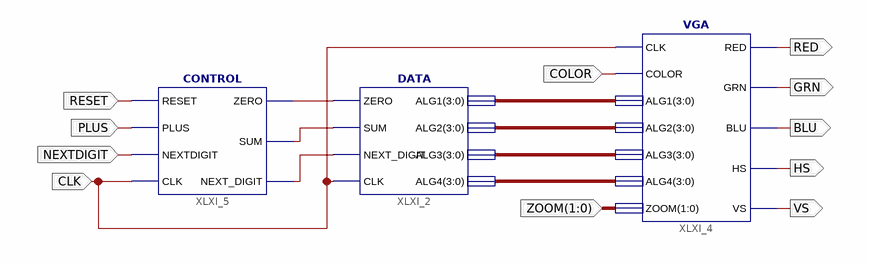
[diagram p0: schematic sheet 1]
// Xilinx ISE schematic MODULE.sch (spartan3) as structural Verilog: 3 symbols, 11 ports
module MODULE (
  input  RESET,
  input  PLUS,
  input  NEXTDIGIT,
  input  CLK,
  input  COLOR,
  input  [1:0] ZOOM,
  output RED,
  output GRN,
  output BLU,
  output VS,
  output HS
);

  wire XLXN_7, XLXN_8, XLXN_9;
  wire [3:0] XLXN_13, XLXN_14, XLXN_15, XLXN_16;

  DATA XLXI_2 (
    .ZERO(XLXN_7), .SUM(XLXN_8), .NEXT_DIGIT(XLXN_9), .CLK(CLK), .ALG1(XLXN_13), .ALG2(XLXN_14),
    .ALG3(XLXN_15), .ALG4(XLXN_16));
  CONTROL XLXI_5 (
    .RESET(RESET), .PLUS(PLUS), .NEXTDIGIT(NEXTDIGIT), .CLK(CLK), .ZERO(XLXN_7), .SUM(XLXN_8),
    .NEXT_DIGIT(XLXN_9));
  VGA XLXI_4 (
    .CLK(CLK), .COLOR(COLOR), .ALG1(XLXN_13), .ALG2(XLXN_14), .ALG3(XLXN_15), .ALG4(XLXN_16), .ZOOM(ZOOM),
    .RED(RED), .GRN(GRN), .BLU(BLU), .HS(HS), .VS(VS));
endmodule
